# EAGLE design pulse-oximeter (EAGLE 9.6.2)
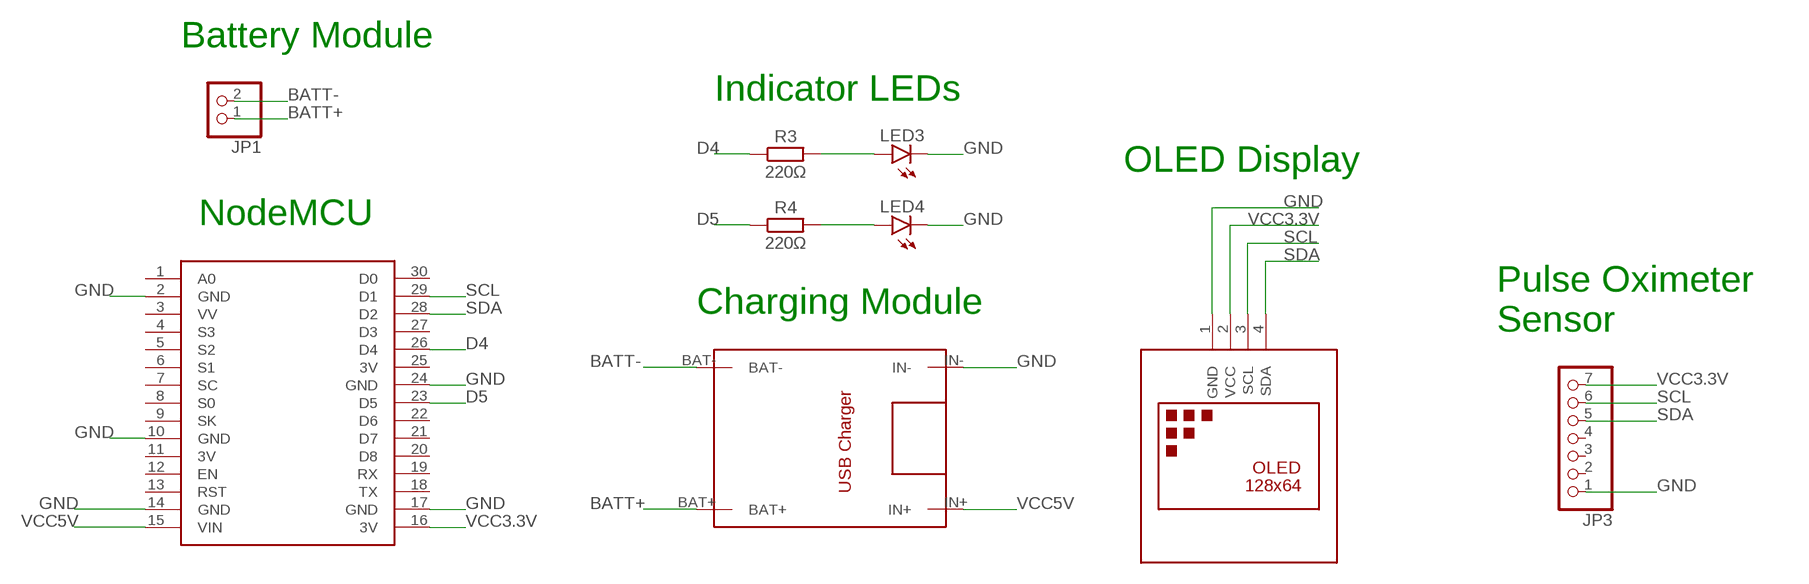
[diagram p0: schematic, sheet 1]

## Parts
JP1  PINHD-1X2  [1X02]
JP3  PINHD-1X7  [1X07]
LED3  LED3MM  [LED3MM]
LED4  LED3MM  [LED3MM]
R3  220Ω  R_AXIAL-11.7MM-PITCH  [RESAD1176W63L850D250B]
R4  220Ω  R_AXIAL-11.7MM-PITCH  [RESAD1176W63L850D250B]
U$1  DISPLAY-OLED-128X64-I2C  [DISPLAY-OLED-128X64-I2C]
U$2  NODEMCU  [NODEMCU]
U$3  TP4056  [TP4056]

## Nets
BATT+: JP1.1 U$3.BAT+
BATT-: JP1.2 U$3.BAT-
D4: R3.1 U$2.26(D4)
D5: R4.1 U$2.23(D5)
GND: JP3.1 LED3.K(C) LED4.K(C) U$1.1(GND) U$2.2(GND) U$2.10(GND) U$2.14(GND) U$2.17(GND) U$2.24(GND) U$3.IN-
N$1: LED3.A R3.2
N$2: LED4.A R4.2
SCL: JP3.6 U$1.3(SCL) U$2.29(D1)
SDA: JP3.5 U$1.4(SDA) U$2.28(D2)
VCC3.3V: JP3.7 U$1.2(VCC) U$2.16(3V)
VCC5V: U$2.15(VIN) U$3.IN+
Unconnected: JP3.2 JP3.3 JP3.4 U$2.1(A0) U$2.3(VV) U$2.4(S3) U$2.5(S2) U$2.6(S1) U$2.7(SC) U$2.8(S0) U$2.9(SK) U$2.12(EN) U$2.13(RST) U$2.18(TX) U$2.19(RX) U$2.20(D8) U$2.21(D7) U$2.22(D6) U$2.27(D3) U$2.30(D0)

## Notes on the sheet
- Battery Module
- Indicator LEDs
- OLED Display
- NodeMCU
- Charging Module
- Pulse Oximeter
  Sensor

## Power pins joined to a net without a drawn wire
3V: U$2.11(3V) U$2.25(3V)

## Library data of the parts
JP1 = pinhead:PINHD-1X2: PIN HEADER
JP3 = pinhead:PINHD-1X7: PIN HEADER
LED3 LED4 = led:LED: LED OSRAM: - CHIPLED LG R971, LG N971, LY N971, LG Q971, LY Q971, LO R971, LY R971 LH N974, LH R974 LS Q976, LO Q976, LY Q976 LO Q996 - Hyper CHIPLED LW Q18S LB Q993, LB Q99A, LB R99A - SideLED LS A670, LO A670, LY A670, LG A670, LP A670 LB A673, LV A673, LT A673, LW A673 LH A674 LY A675 LS A676, LA A676, LO A676, LY A676, LW A676 LS A679, LY A679, LG A679 - Hyper Micro SIDELED® LS Y876, LA Y876, LO Y876, LY Y876 LT Y87S - SmartLED LW L88C, LW L88S LB L89C, LB L89S, LG L890 LS L89K, LO L89K, LY L89K LS L896, LA L896, LO L896, LY L896 - TOPLED LS T670, LO T670, LY T670, LG T670, LP T670 LSG T670, LSP T670, LSY T670, LOP T670, LYG T670 LG T671, LOG T671, LSG T671 LB T673, LV T673, LT T673, LW T673 LH T674 LS T676, LA T676, LO T676, LY T676, LB T676, LH T676, LSB T676, LW T676 LB T67C, LV T67C, LT T67C, LS T67K, LO T67K, LY T67K, LW E67C LS E67B, LA E67B, LO E67B, LY E67B, LB E67C, LV E67C, LT E67C LW T67C LS T679, LY T679, LG T679 LS T770, LO T770, LY T770, LG T770, LP T770 LB T773, LV T773, LT T773, LW T773 LH T774 LS E675, LA E675, LY E675, LS T675 LS T776, LA T776, LO T776, LY T776, LB T776 LHGB T686 LT T68C, LB T68C - Hyper Mini TOPLED® LB M676 - Mini TOPLED Santana® LG M470 LS M47K, LO M47K, LY M47K Source: http://www.osram.convergy.de LUXEON: - LUMILED® LXK2-PW12-R00, LXK2-PW12-S00, LXK2-PW14-U00, LXK2-PW14-V00 LXK2-PM12-R00, LXK2-PM12-S00, LXK2-PM14-U00 LXK2-PE12-Q00, LXK2-PE12-R00, LXK2-PE12-S00, LXK2-PE14-T00, LXK2-PE14-U00 LXK2-PB12-K00, LXK2-PB12-L00, LXK2-PB12-M00, LXK2-PB14-N00, LXK2-PB14-P00, LXK2-PB14-Q00 LXK2-PR12-L00, LXK2-PR12-M00, LXK2-PR14-Q00, LXK2-PR14-R00 LXK2-PD12-Q00, LXK2-PD12-R00, LXK2-PD12-S00 LXK2-PH12-R00, LXK2-PH12-S00 LXK2-PL12-P00, LXK2-PL12-Q00, LXK2-PL12-R00 Source: www.luxeon.com KINGBRIGHT: KA-3528ASYC Source: www.kingbright.com
R3 R4 = Resistor:R: Resistor Fixed - Generic; CATEGORY: Resistor; SUB-CATEGORY: Fixed
U$1 = diy-modules:DISPLAY-OLED-128X64-I2C: 128x64 Dot Matrix OLED Module based on SSD1306 chip Variant with I2C interface More details available here: http://www.instructables.com/id/Monochrome-096-i2c-OLED-display-with-arduino-SSD13/ SSD1306 datasheet: https://cdn-shop.adafruit.com/datasheets/SSD1306.pdf Click here to find device on ebay.com <http://www.ebay.com/sch/oled+display+128x64+iic> Note: There are two variants: I2C and SPI. Search for the proper version.
U$2 = nodemcu:NODEMCU
U$3 = TP4056 charging module:TP4056

## Board
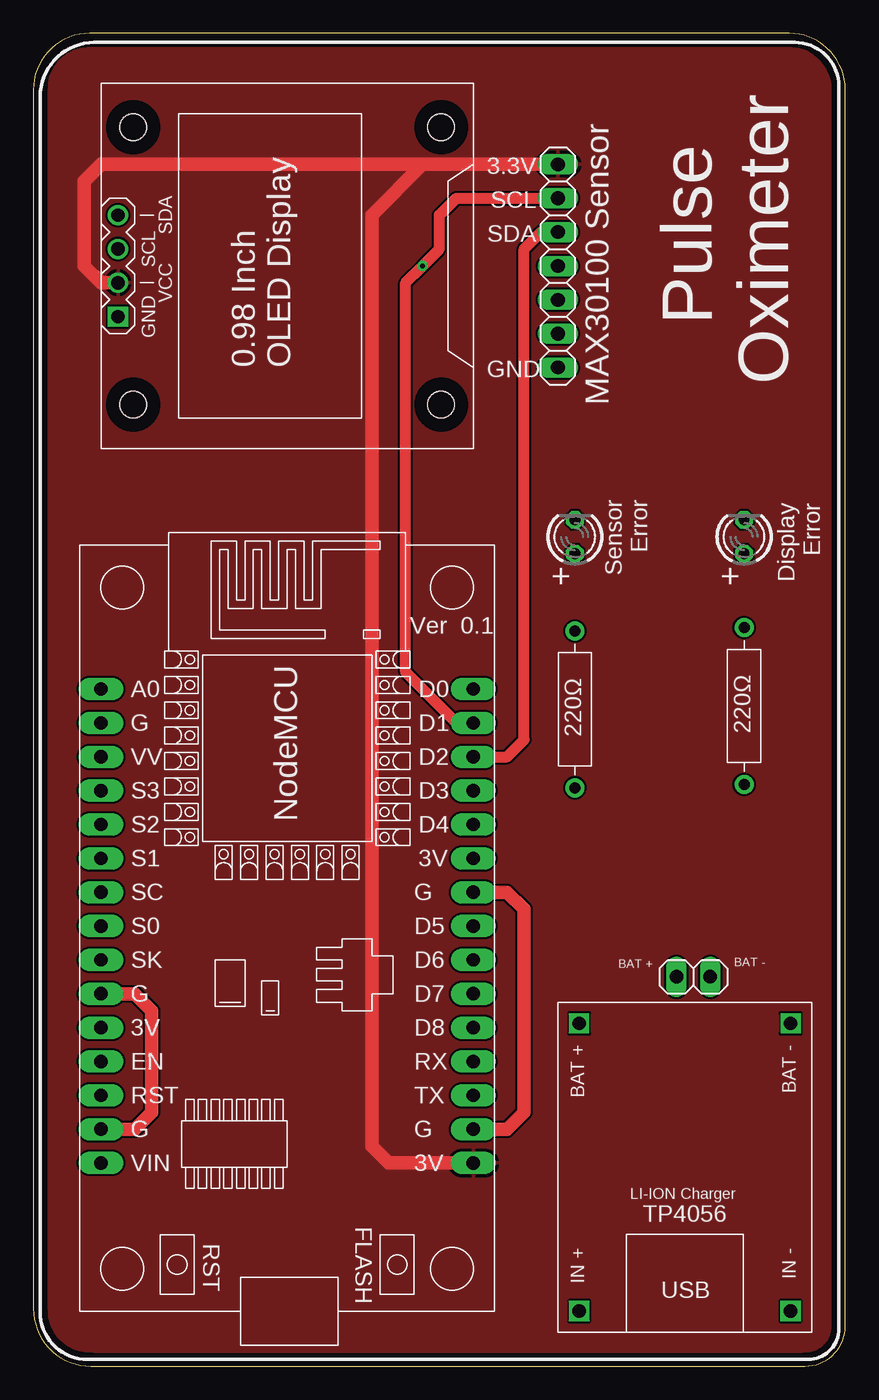
[diagram p1: board, top side]
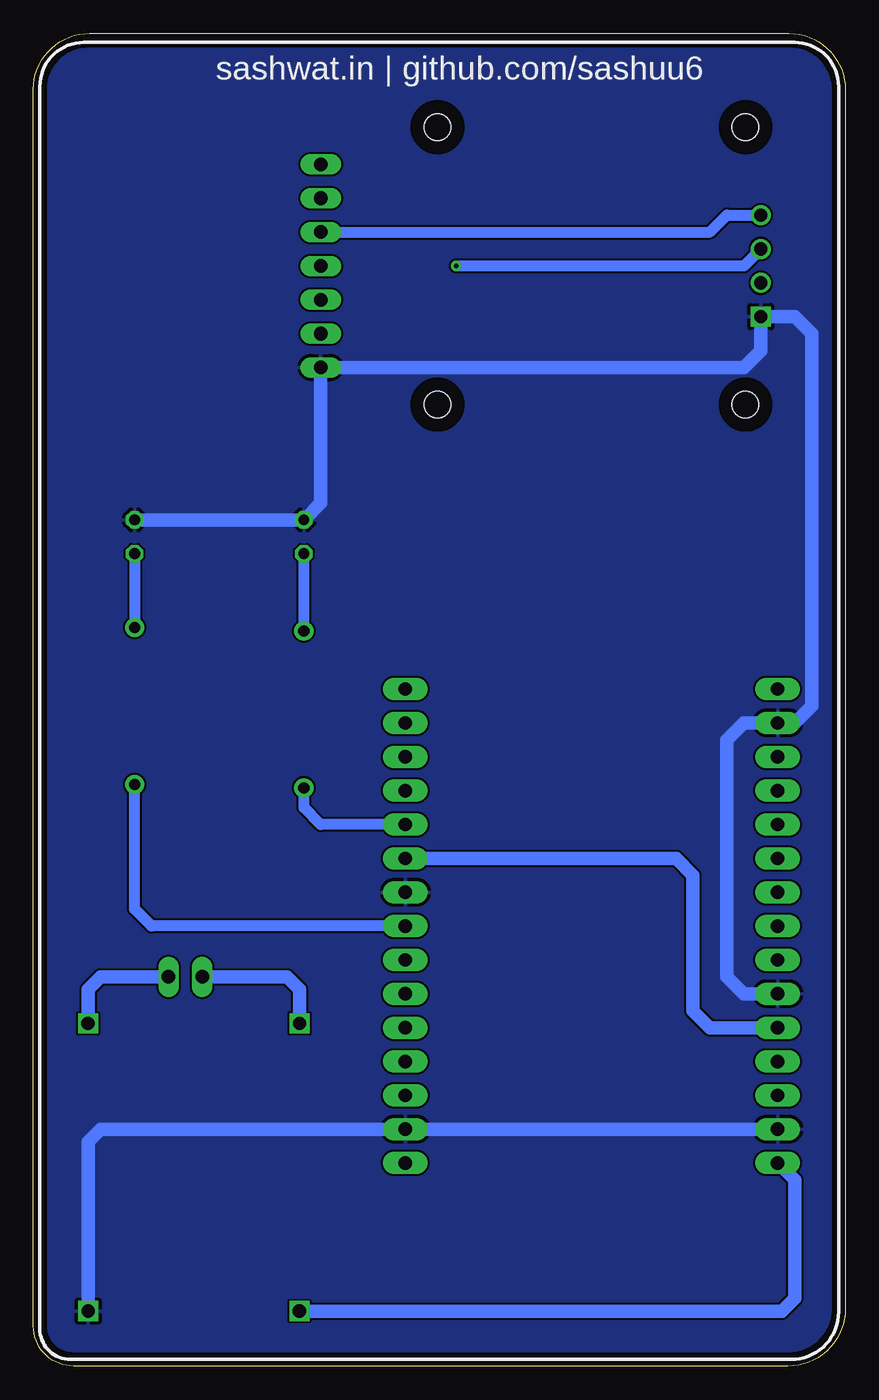
[diagram p2: board, bottom side, seen from below]

Size 60.94 x 100 mm. Coordinates in mm from the lower left corner, seen from the top.
Outline: 4.32,0 57.91,0 arc90 60.94,3.03 60.94,95.78 arc90 56.72,100 4.24,100 arc90 0,95.76 0,4.32 arc90 4.32,0
Copper layers (1*16): Top 0.035mm / dielectric 1.5mm / Bottom 0.035mm
Design rules "default": minimum track width 6mil, minimum drill 0.35mm, track to track 6mil, track to pad 6mil, pad to pad 6mil, via to via 6mil, smd to smd 6mil, copper to edge 40mil, drill to drill 6mil, minimum pad ring 10mil, minimum via ring 8mil, stop-mask expansion 4mil, vias tented up to drill 0mil, thermal gap 10mil

### Footprints (pad centres in the part's own frame; a part is rotated, then mirrored left to right if it is on the bottom)
1X02 = drill 1.016 long: 1 -1.27,0; 2 1.27,0
1X07 = drill 1.016 long: 1 -7.62,0; 2 -5.08,0; 3 -2.54,0; 4 0,0; 5 2.54,0; 6 5.08,0; 7 7.62,0
LED3MM = drill 0.813 octagon: A -1.27,0; K 1.27,0
RESAD1176W63L850D250B = drill 0.83 pad 1.43: 1 -5.88,0; 2 5.88,0
DISPLAY-OLED-128X64-I2C = drill 1 square: 1 -3.81,12.7 | drill 1: 2 -1.27,12.7; 3 1.27,12.7; 4 3.81,12.7 | hole 2: -10.414,11.557; 10.414,11.557; 10.414,-11.557; -10.414,-11.557
NODEMCU = drill 1 pad 1.676 long: 1 -13.97,17.78; 2 -13.97,15.24; 3 -13.97,12.7; 4 -13.97,10.16; 5 -13.97,7.62; 6 -13.97,5.08; 7 -13.97,2.54; 8 -13.97,0; 9 -13.97,-2.54; 10 -13.97,-5.08; 11 -13.97,-7.62; 12 -13.97,-10.16; 13 -13.97,-12.7; 14 -13.97,-15.24; 15 -13.97,-17.78; 16 13.97,-17.78; 17 13.97,-15.24; 18 13.97,-12.7; 19 13.97,-10.16; 20 13.97,-7.62; 21 13.97,-5.08; 22 13.97,-2.54; 23 13.97,0; 24 13.97,2.54; 25 13.97,5.08; 26 13.97,7.62; 27 13.97,10.16; 28 13.97,12.7; 29 13.97,15.24; 30 13.97,17.78
TP4056 = drill 1 pad 1.422 square: BAT+ 8.572,-10.477; BAT- -7.303,-10.477; IN+ 8.565,11.105; IN- -7.295,11.105

### Placement (x,y rotation side)
JP1  49.53,29.21 0 top
JP3  39.37,82.55 90 top
LED3  40.64,62.23 90 top
LED4  53.34,62.23 90 top
R3  40.64,49.28 90 top
R4  53.34,49.53 90 top
U$1  19.05,82.55 90 top
U$2  19.05,33.02 0 top
U$3  49.53,15.24 180 top

### Tracks (layer width: path | path; a pad name or v marks a point on that pad's centre or on a via)
3V
  Bottom 1.016: U$2.11 10.16,25.4 11.43,26.67 11.43,36.83 12.7,38.1 U$2.25
BATT+
  Bottom 1.016: U$3.BAT+ 40.96,28.26 41.91,29.21 JP1.1
BATT-
  Bottom 1.016: JP1.2 55.88,29.21 56.83,28.26 U$3.BAT-
D4
  Bottom 0.813: U$2.26 39.37,40.64 40.64,41.91 R3.1
D5
  Bottom 0.813: U$2.23 52.07,33.02 53.34,34.29 R4.1
GND
  Top 1.016: U$2.24 35.56,35.56 36.83,34.29 36.83,19.05 35.56,17.78 U$2.17 | U$2.14 7.62,17.78 8.89,19.05 8.89,26.67 7.62,27.94 U$2.10
  Bottom 1.016: U$3.IN- 56.83,16.84 55.88,17.78 U$2.17 U$2.14 | LED4.K LED3.K 39.37,64.77 JP3.1 7.62,74.93 6.35,76.2 U$1.1 3.81,78.74 2.54,77.47 2.54,49.53 3.81,48.26 U$2.2 7.62,48.26 8.89,46.99 8.89,29.21 7.62,27.94 U$2.10
  pour Bottom: 4.06,99.31 57.66,99.31 arc-90 60.45,96.52 60.45,2.79 arc-90 58.17,0.51 57.4,0.51 4.06,0.51 arc-90 0.51,4.06 0.51,4.32 0.51,96.01 arc-90 3.81,99.31
N$1
  Bottom 0.813: R3.2 LED3.A
N$2
  Bottom 0.813: LED4.A R4.2
SCL  (via drill 0.35)
  Top 0.813: JP3.6 31.75,87.63 30.48,86.36 30.48,83.82 v29.21,82.55 27.94,81.28 27.94,52.07 31.75,48.26 U$2.29
  Bottom 0.813: U$1.3 7.62,82.55 v29.21,82.55
SDA
  Top 0.813: U$2.28 35.56,45.72 36.83,46.99 36.83,83.82 38.1,85.09 JP3.5
  Bottom 0.813: JP3.5 10.16,85.09 8.89,86.36 U$1.4
VCC3.3V
  Top 1.016: U$2.16 26.67,15.24 25.4,16.51 25.4,86.36 29.21,90.17 | JP3.7 29.21,90.17 | 29.21,90.17 5.08,90.17 3.81,88.9 3.81,82.55 5.08,81.28 U$1.2
  pour Top: 0.51,96.01 arc-90 3.81,99.31 57.66,99.31 arc-90 60.45,96.52 60.45,2.79 arc-90 58.17,0.51 4.06,0.51 arc-90 0.51,4.06
VCC5V
  Bottom 1.016: U$3.IN+ 4.75,4.13 3.81,5.08 3.81,13.97 U$2.15

### Text on the board
tPlace: 3.3V | SCL | SDA | 0.98 Inch / OLED Display | GND | Pulse / Oximeter | MAX30100 Sensor | Sensor / Error | Display / Error | + | + | 220Ω | 220Ω | NodeMCU | BAT + | BAT -
bPlace: sashwat.in | github.com/sashuu6